# Altium project PCB_Project.PrjPcb
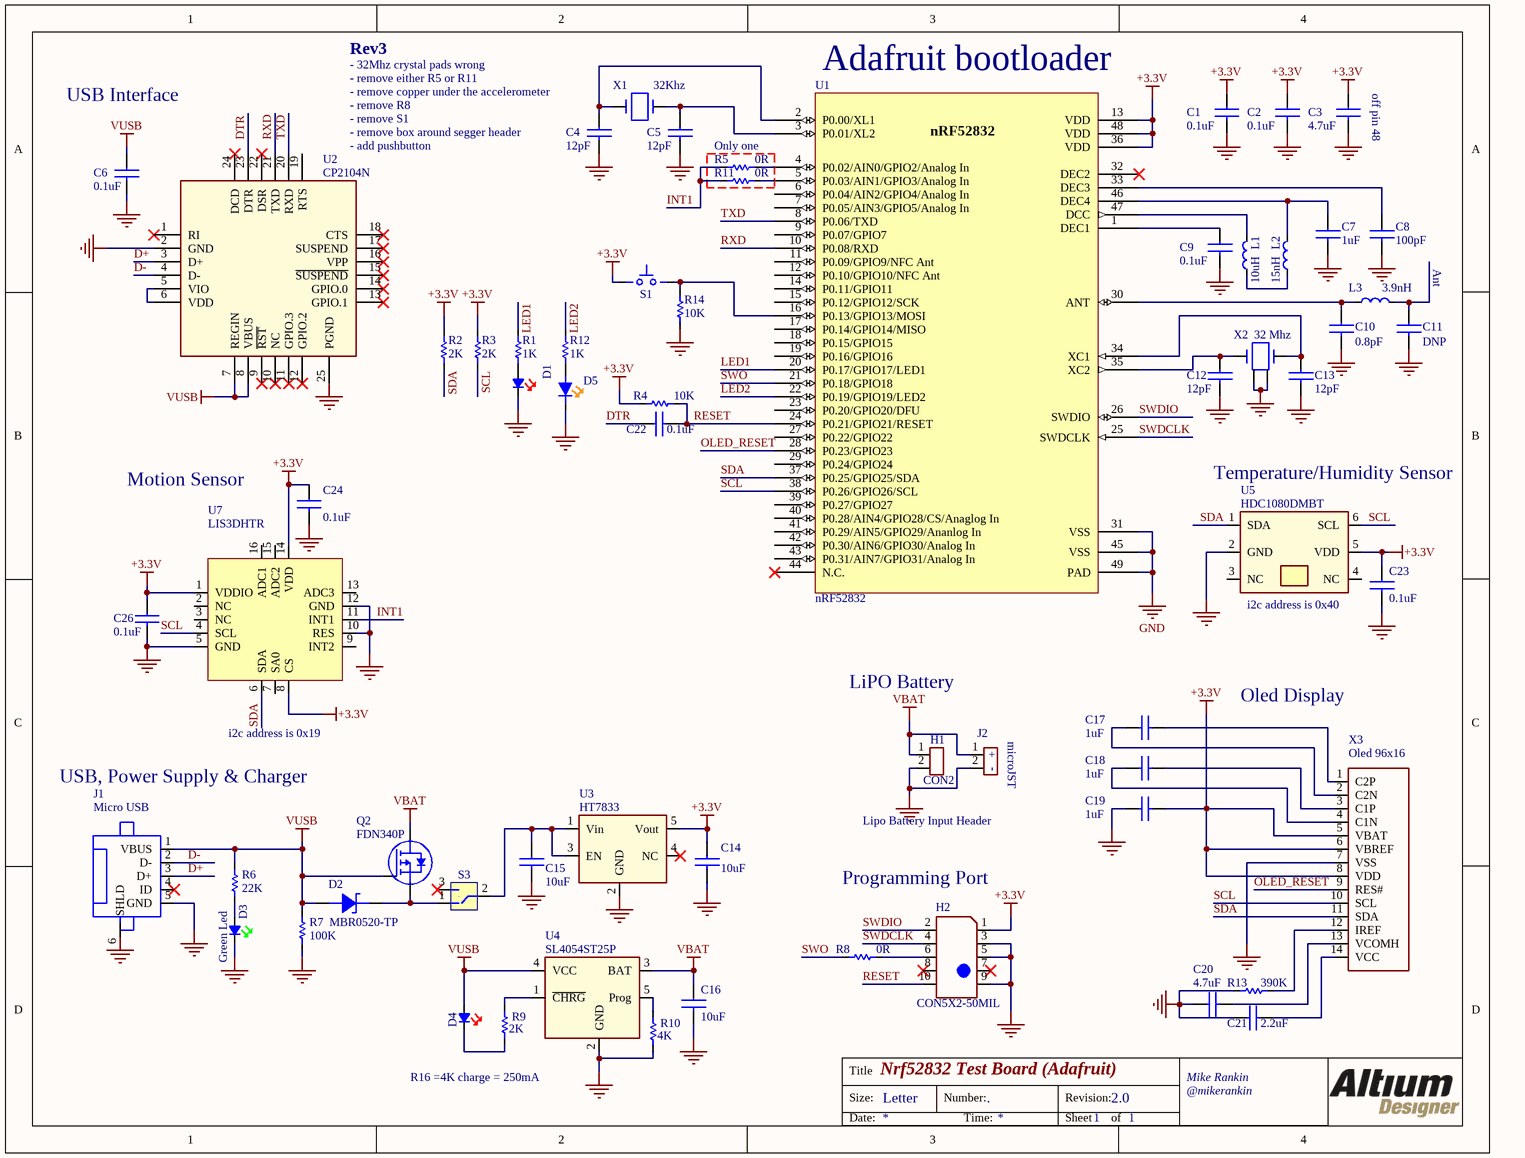
[diagram p0: Schematic_Rev2.SchDoc]
1 sheet, 63 parts. Net scope: global (net labels, ports and power ports of the same name join across sheets).
Board file: PCB_Rev4.PcbDoc

## Sheet Schematic_Rev2.SchDoc: Nrf52832 Test Board (Adafruit)
size Letter; Address1: Mike Rankin; Address2: @mikerankin; DocumentNumber: .; Revision: 2.0; SheetNumber: 1; SheetTotal: 1

### Parts
C1  0.1uF  [CAPC1005X56N]
C2  0.1uF  [CAPC1005X56N]
C3  4.7uF  [CAPC1005X56N]
C4  12pF  [CAPC1005X56N]
C5  12pF  [CAPC1005X56N]
C6  0.1uF  [CAPC1005X56N]
C7  1uF  [CAPC1005X56N]
C8  100pF  [CAPC1005X56N]
C9  0.1uF  [CAPC1005X56N]
C10  0.8pF  [CAPC1005X56N]
C11  DNP  [CAPC1005X56N]  (no BOM)
C12  12pF  [CAPC1005X56N]
C13  12pF  [CAPC1005X56N]
C14  10uF  [CAPC2012X140N]
C15  10uF  [CAPC2012X140N]
C16  10uF  [CAPC2012X140N]
C17  1uF  [CAPC1005X56N]
C18  1uF  [CAPC1005X56N]
C19  1uF  [CAPC1005X56N]
C20  4.7uF  [CAPC1005X56N]
C21  2.2uF  [CAPC1005X56N]
C22  0.1uF  [CAPC1005X56N]
C23  0.1uF  [CAPC1005X56N]
C24  0.1uF  [RESC1005X40L]
C26  0.1uF  [CAPC1005X56N]
D1  Red Led  [LED1608X55N-RED]  (value not drawn)
D2  MBR0520-TP  [SOD123]
D3  Green Led  [LED1608X55N-RED]
D4  Red Led  [LED1608X55N-RED]  (value not drawn)
D5  Orange Led  [LED1608X55N-YELLOW]  (value not drawn)
H1  CON2  [HDR1X2-EMPTY]
H2  CON5X2-50MIL  [HDR5X2-50MIL-SMT]
J1  Micro USB  [U254-051N-4BH806]
J2  CON2  [JST_Micro_2PIN]  (value not drawn)  (no BOM)
L1  10uH  [RESC1608X06L]
L2  15nH  [INDC1005X40L]
L3  3.9nH  [INDC1005X40L]
Q2  FDN340P  [SOT95P240X110-3N]
R1  1K  [RESC1005X40L]
R2  2K  [RESC1005X40L]
R3  2K  [RESC1005X40L]
R4  10K  [RESC1005X40L]
R5  0R  [RESC1005X40L]
R6  22K  [RESC1005X40L]
R7  100K  [RESC1005X40L]
R8  0R  [RESC1005X40L]
R9  2K  [RESC1005X40L]
R10  4K  [RESC1005X40L]
R11  0R  [RESC1005X40L]
R12  1K  [RESC1005X40L]
R13  390K  [RESC1005X40L]
R14  10K  [RESC1005X40L]
S1  Pushbutton  [TL1015AF160QG]  (value not drawn)
S3  SWITCH SLIDE  [SK-3245D-02-L4]  (value not drawn)
U1  value nRF52832  [QFN48]  (hidden comment: NRF52832-QFAA-R)
U2  CP2104N  [24-QFN]
U3  HT7833  [SOT95P280X144-5N]
U4  SL4054ST25P  [SOT95P280X144-5N]
U5  HDC1080DMBT  [HDC1080]
U7  LIS3DHTR  [QFN3X3_16_1.2]
X1  32Khz  [ECS-.327-12.5-34B]
X2  32 Mhz  [OSC20X16]
X3  OLED_GLASS 96x16  [OLED_GLASS 96x16]  (value not drawn)

### Nets
+3.3V: C1.1 C2.1 C3.1 C14.1 C19.2 C23.1 C24.1 C26.1 H2.1 R2.2 R3.2 R4.2 S1.1(A) U1.13(VDD) U1.36(VDD) U1.48(VDD) U3.5(Vout) U5.5(VDD) U7.1(VDDIO) U7.8(CS) U7.14(VDD) X3.5(VBAT) X3.6(VBREF) X3.8(VDD)
GND: C1.2 C2.2 C3.2 C4.2 C5.2 C6.2 C7.2 C8.2 C9.2 C10.2 C11.2 C12.2 C13.2 C14.2 C15.2 C16.2 C19.1 C20.1 C21.1 C23.2 C24.2 C26.2 D1.1 D3.1 D5.1 H1.2 H2.3 H2.5 H2.9 J1.5(GND) J1.6(SHLD) J2.2 R7.1 R10.1 R13.1 R14.2 U1.31(VSS) U1.45(VSS) U1.49(PAD) U2.2(GND) U2.25(PGND) U3.2(GND) U4.2(GND) U5.2(GND) U7.5(GND) U7.10(RES) U7.12(GND) X2.2 X2.4 X3.7(VSS)
VBAT: C16.1 H1.1 J2.1 Q2.3(D) U4.3(BAT)
VUSB: C6.1 D2.2(Annode) D4.2 J1.1(VBUS) Q2.1(G) R6.2 R7.2 U2.7(REGIN) U2.8(VBUS) U4.4(VCC)
D+: J1.3(D+) U2.3(D+)
D-: J1.2(D-) U2.4(D-)
DTR: C22.1 U2.23(DTR)
INT1: R5.2 R11.2 U7.11(INT1)
LED1: R1.2 U1.20(P0.17/GPIO17/LED1)
LED2: R12.2 U1.22(P0.19/GPIO19/LED2)
OLED_RESET: U1.28(P0.23/GPIO23) X3.9(RES#)
RESET: C22.2 H2.10 R4.1 U1.24(P0.21/GPIO21/RESET)
RXD: U1.10(P0.08/RXD) U2.21(TXD)
SCL: R3.1 U1.38(P0.26/GPIO26/SCL) U5.6(SCL) U7.4(SCL) X3.10(SCL)
SDA: R2.1 U1.37(P0.25/GPIO25/SDA) U5.1(SDA) U7.6(SDA) X3.11(SDA)
SWDCLK: H2.4 U1.25(SWDCLK)
SWDIO: H2.2 U1.26(SWDIO)
SWO: R8.1 U1.21(P0.18/GPIO18)
TXD: U1.8(P0.06/TXD) U2.20(RXD)
NetC4_1: C4.1 U1.2(P0.00/XL1) X1.1
NetC5_1: C5.1 U1.3(P0.01/XL2) X1.2
NetC7_1: C7.1 L2.2 U1.46(DEC4)
NetC8_1: C8.1 U1.33(DEC3)
NetC9_1: C9.1 U1.1(DEC1)
NetC10_1: C10.1 L3.1 U1.30(ANT)
NetC11_1: C11.1 L3.2
NetC12_1: C12.1 U1.35(XC2) X2.1
NetC13_1: C13.1 U1.34(XC1) X2.3
NetC15_1: C15.1 S3.2 U3.1(Vin) U3.3(EN)
NetC17_1: C17.1 X3.2(C2N)
NetC17_2: C17.2 X3.1(C2P)
NetC18_1: C18.1 X3.4(C1N)
NetC18_2: C18.2 X3.3(C1P)
NetC20_2: C20.2 X3.13(VCOMH)
NetC21_2: C21.2 X3.14(VCC)
NetD1_2: D1.2 R1.1
NetD2_1: D2.1(Cathode) Q2.2(S) S3.1
NetD3_2: D3.2 R6.1
NetD4_1: D4.1 R9.1
NetD5_2: D5.2 R12.1
NetH2_6: H2.6 R8.2
NetL1_1: L1.1 L2.1
NetL1_2: L1.2 U1.47(DCC)
NetR5_1: R5.1 U1.4(P0.02/AIN0/GPIO2/Analog_In)
NetR9_2: R9.2 U4.1(~{CHRG})
NetR10_2: R10.2 U4.5(Prog)
NetR11_1: R11.1 U1.5(P0.03/AIN1/GPIO3/Analog_In)
NetR13_2: R13.2 X3.12(IREF)
NetR14_1: R14.1 S1.2(B) U1.16(P0.13/GPIO13/MOSI)
NetU2_5: U2.5(VIO) U2.6(VDD)

Not connected (* = marked no-connect by the designer): H2 7* 8*; J1 4(ID)*; S3 3*; U1 6(P0.04/AIN2/GPIO4/Analog_In) 7(P0.05/AIN3/GPIO5/Analog_In) 9(P0.07/GPIO7) 11(P0.09/GPIO9/NFC_Ant) 12(P0.10/GPIO10/NFC_Ant) 14(P0.11/GPIO11) 15(P0.12/GPIO12/SCK) 17(P0.14/GPIO14/MISO) 18(P0.15/GPIO15) 19(P0.16/GPIO16) 23(P0.20/GPIO20/DFU) 27(P0.22/GPIO22) 29(P0.24/GPIO24) 32(DEC2)* 39(P0.27/GPIO27) 40(P0.28/AIN4/GPIO28/CS/Anaglog_In) 41(P0.29/AIN5/GPIO29/Ananlog_In) 42(P0.30/AIN6/GPIO30/Analog_In) 43(P0.31/AIN7/GPIO31/Analog_In) 44(N.C.)*; U2 1(RI)* 9(~{RST})* 10(NC)* 11(GPIO.3)* 12(GPIO.2)* 13(GPIO.1)* 14(GPIO.0)* 15(~{SUSPEND})* 16(VPP)* 17(SUSPEND)* 18(CTS)* 19(RTS) 22(DSR)* 24(DCD)*; U3 4(NC)*; U5 3(NC) 4(NC); U7 2(NC) 3(NC) 7(SA0) 9(INT2) 13(ADC3) 15(ADC2) 16(ADC1)

### Notes on the sheet
- USB Interface
- Rev3
- - 32Mhz crystal pads wrong
- - remove either R5 or R11
- - remove copper under the accelerometer
- Adafruit bootloader
- (near C3) off pin 48
- - remove R8
- - remove S1
- - remove box around segger header
- (near U2) - add pushbutton
- (near R5) Only one
- Ant
- Motion Sensor
- (near U5) Temperature/Humidity Sensor
- i2c address is 0x40
- LiPO Battery
- Oled Display
- (near U7) i2c address is 0x19
- (near J2) microJST
- (near X3) Oled 96x16
- USB, Power Supply & Charger
- Lipo Battery Input Header
- (near H2) Programming Port
- R16 =4K charge = 250mA
- Title
- Size:
- Letter
- Number:
- Revision:
- Date:
- Time:
- Sheet
- of
- (in symbol JST_Micro_CONN_2PIN) +; -

### Library data of the parts
C1 C2 C6 C9 C22 = CAP_0402: CAP 0.1uF 0402; Part_Footprint: 0402; Vendor: LCSC; Value: 0.1uF
C3 = CAP_0402: CAP 4.7uF 0402; Part_Footprint: 0402; Vendor: LCSC; Value: 4.7uF
C4 C5 C12 C13 = CAP_0402: CAP 12pF 0402; Part_Footprint: 0402; Vendor: LCSC; Value: 12pF
C7 = CAP_0402: CAP 1uF 0402; Part_Footprint: 0402; Vendor: LCSC; Value: 1uF
C8 = CAP_0402: CAP 100pF 0402; Part_Footprint: 0402; Vendor: LCSC; Value: 100pF
C10 = CAP_0402: CAP 0.8pF 0402; Part_Footprint: 0402; Vendor: LCSC; Value: 0.8pF
C11 = CAP_0402: CAP DNP 0402; Part_Footprint: 0402; Vendor: LCSC; Value: DNP
C14-C16 = CAP_0805: CAP 10uF 0805; Part_Footprint: 0805; Value: 10uF
C17-C19 = CAP_0402: CAP 0.1uF 16V 0402; Part_Number: C29266; Manufacturer: Samsung; Part_Footprint: 0402; Vendor: LCSC; Value: 1uF
C20 = CAP_0402: CAP 4.7uF 16V 0402; Part_Number: C318563; Manufacturer: Samsung; Part_Footprint: 0402; Vendor: LCSC; Value: 4.7uF
C21 = CAP_0402: CAP 2.2uF 16V 0402; Part_Number: C170151; Manufacturer: Samsung; Part_Footprint: 0402; Vendor: LCSC; Value: 2.2uF
C23 = CAP_0402: CAP 0.1uF 0402; PartNumber: TCC0402X5R104M160AT; Manufacturer: CCTC; Vendor: LCSC; Value: 0.1uF
C24 C26 = CAP_0402: CAP 0.1uF 0402; PartNumber: C344190; Manufacturer: CCTC; Vendor: LCSC; Value: 0.1uF
D1 D4 = LED_0603_SMALL_RED: LED RED 0603; Part_Footprint: 0603; Value: Red Led
D2 = MBR0520-TP: DIODE SCHOTTKY 20V 500MA SOD-123; Manufacturer: Micro; Part_Number: C78746; Vendor: LCSC; Value: MBR0520; Part_Footprint: SOD-123
D3 = LED_0603_SMALL_GREEN: LED Green 0603; Part_Footprint: 0603; Vendor: LCSC; Value: Green Led
D5 = LED_0603_Orange: LED Orange 0603; Part_Footprint: 0603; Value: Orange Led
H1 = CON2-EMPTY_PAD: EMPTY SOLDER 2POS
H2 = CON5X2_50mil: JTAG CONN HEADER 5X2POS 50mil" PADS; PartNumber: PADS
J1 = U254-051N-4BH806: CONN RECPT MICRO USB; Manufacturer: XKB; Part_Number: C319170; Part_Footprint: SMT; Vendor: LCSC; Value: Micro USB
J2 = JST_Micro_CONN_2PIN: JST MIcro CONN 2POS
L1 = LQW15AN3N9D10D: INDUCTOR 10uH 900mA 0603; Manufacturer: Murata; Value: 10uH; Part_Footprint: *
L2 = LQW15AN3N9D10D: INDUCTOR 15nH 900mA 0402; Vendor: LCSC; Value: 15nH; Part_Footprint: *
L3 = LQW15AN3N9D10D: INDUCTOR 3.9nH 900mA 0402; Part_Number: C412344; Manufacturer: Murata; Vendor: LCSC; Value: 3.9nH; Part_Footprint: *
Q2 = FDN340P: MOSFET P-CH 20V 2A SOT-23; Manufacturer: On Semi; Part_Number: C75469; Vendor: LCSC; Part_Footprint: SOT-23; Value: Mosfet P-CH
R1 R12 = RES_0402: RES 1K 0402; Part_Footprint: 0402; Vendor: LCSC; Value: 1K
R2 R3 R9 = RES_0402: RES 2K 0402; Part_Footprint: 0402; Vendor: LCSC; Value: 2K
R4 R14 = RES_0402: RES 10K 0402; Part_Footprint: 0402; Vendor: LCSC; Value: 10K
R5 R8 R11 = RES_0402: RES 0R 0402; Part_Footprint: 0402; Vendor: LCSC; Value: 0R
R6 = RES_0402: RES 22K 0402; Part_Footprint: 0402; Vendor: LCSC; Value: 22K
R7 = RES_0402: RES 100K 0402; Part_Footprint: 0402; Vendor: LCSC; Value: 100K
R10 = RES_0402: RES 4K 0402; Part_Footprint: 0402; Vendor: LCSC; Value: 4K
R13 = RES_0402: RES 390K 0402; Part_Number: C25782; Manufacturer: Uniroyal; Part_Footprint: 0402; Vendor: LCSC; Value: 390K
S1 = TL1015AF160QG: Switch SMD,3x4x2.5mm; Part_Number: C455281; Manufacturer: Xunpu; Vendor: LCSC; Part_Footprint: SMD; Value: Pushbutton
S3 = SK-3245D-02-L4: Switch Slide Thu Hole; Manufacturer: KXB Enterprise; Vendor: LCSC; PartNumber: SK-3245D-02-L4; Value: SWITCH SLIDE
U1 = nRF52832: MCU Bluetooth 2.4GHz 48-VFQFN Exposed Pad; Manufacturer: Nordic Semi; Part_Footprint: QFN-48; Part_Number: C77540; Vendor: LCSC; ComponentLink1URL: *; ComponentLink1Description: Datasheet; ComponentLink2URL: *; ComponentLink2Description: Supplier link
U2 = CP2104-F03-GMR: IC BRIDGE USB TO UART 24QFN; Manufacturer: Silicon Labs; Part_Number: C47742; Vendor: LCSC; Part_Footprint: 24QFN; Value: CP2104N
U3 = HT7833: IC LDO 3.3V 0.5A SOT23-5; Manufacturer: Holtek; Part_Number: C164106; Vendor: LCSC; Value: HT7833; Part_Footprint: SOT23-5
U4 = SL4054ST25P: Charger IC Lithium-Ion/Polymer SOT23-5; Manufacturer: Techfuse; PartNumber: C258510; Vendor: LCSC; Value: SL4054ST25P
U5 = HDC1080DMBT: Humidity/Temperature Sensor; Manufacturer: Texas Instruments; Vendor: LCSC; Value: Humidity/Temperature; PartNumber: HDC1080DMBT
U7 = E-05-177: IC ACCEL 2-16G I2C/SPI 16LGA; PartNumber: C15134; Manufacturer: STMicro; Vendor: LCSC; Value: LIS3DHTR
X1 = ECS-.327-12.5-34B: CRYSTAL 32.768 KHZ 12.5PF SMD; Manufacturer: ECS; Vendor: Digi-Key; Part_Number: ECS-.327-12.5-34B; Value: 32Khz
X2 = 32Mhz: CRYSTAL 32MHZ 12PF SMD; Part_Number: 8Y32000001; Manufacturer: TXC Corp; Part_Footprint: C409316; Vendor: LCSC; Value: 32 Mhz
X3 = OLED_GLASS 96x16: 96x16 OLED_GLASS; Part_Number: ER-OLED0.69-1W; Vendor: Buy-Display